# Altium schematic sheet NB992F_XL_N76E003_MAIN.SchDoc
size A4
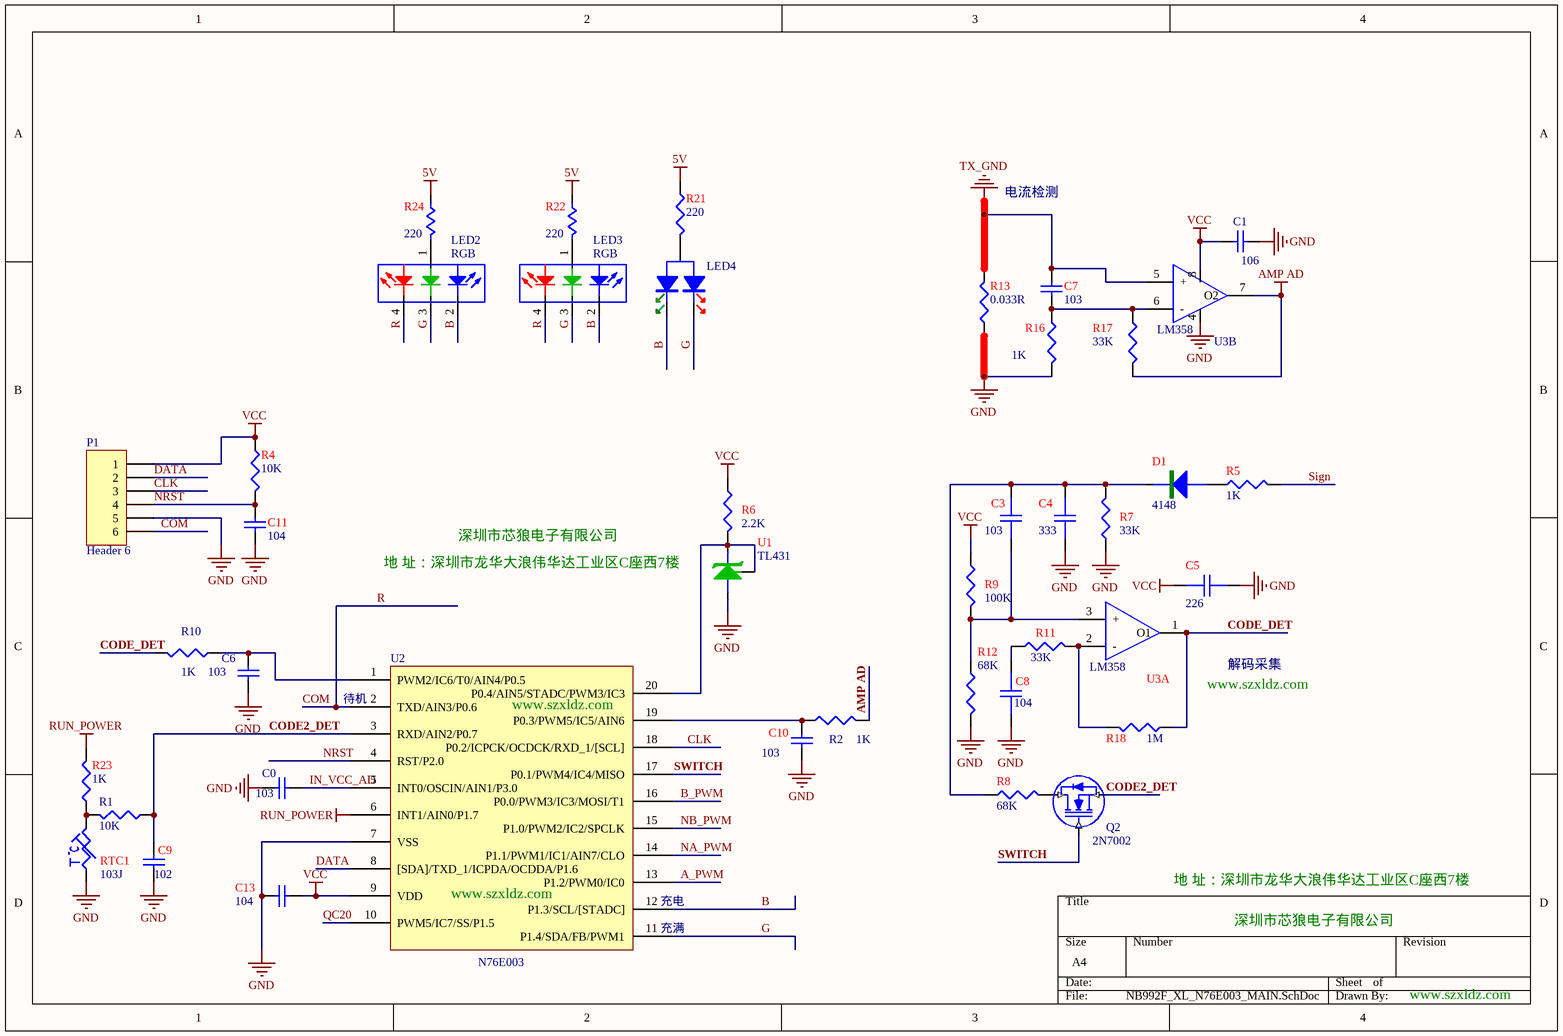
[diagram p0: NB992F_XL_N76E003_MAIN.SchDoc]

## Parts
C0  103  [C0402]
C1  106  [C0603]
C3  103  [C0402]
C4  333  [C0402]
C5  226  [C0805]
C6  103  [C0402]
C7  103  [C0402]
C8  104  [C0402]
C9  102  [C0402]
C10  103  [C0402]
C11  104  [C0402]
C13  104  [C0402]
D1  4148  [sod323]
LED2  RGB  [LED-RGB02]
LED3  RGB  [LED-RGB02]
LED4  (no value)  [LED2]
P1  Header 6  [SPIN6]
Q2  2N7002  [SOT-23B]
R1  10K  [R0402]
R2  1K  [R0402]
R4  10K  [R0402]
R5  1K  [R0402]
R6  2.2K  [R0402]
R7  33K  [R0402]
R8  68K  [R0402]
R9  100K  [R0402]
R10  1K  [R0402]
R11  33K  [R0402]
R12  68K  [R0402]
R13  0.033R  [R0805]
R16  1K  [R0402]
R17  33K  [R0402]
R18  1M  [R0402]
R21  220  [R0402]
R22  220  [R0402]
R23  1K  [R0402]
R24  220  [R0402]
RTC1  103J  [R0402]
U1  TL431  [SOT-23A]
U2  N76E003  [TSSOP20]
U3  LM358  [SOP8]  (parts A,B of 2)

## Nets
5V: R21.1 R22.1 R24.1
AMP AD: R2.2 R17.2 U3.7(O2)
GND: C0.1 C1.1 C4.1 C5.1 C6.1 C8.1 C9.1 C10.2 C11.2 C13.1 P1.5 R7.1 R12.2 R13.1 R16.2 RTC1.1 U1.1 U2.7(VSS) U3.4
RUN_POWER: R23.2 U2.6(INT1/AIN0/P1.7)
TX_GND: C7.1 R13.2 U3.5(+)
VCC: C1.2 C5.2 C13.2 P1.1 R4.1 R6.1 R9.1 U2.9(VDD) U3.8
A_PWM: U2.13(P1.2/PWM0/IC0)
B: LED2.2(A) LED3.2(A) LED4.3 U2.12(P1.3/SCL/[STADC])
B_PWM: U2.16(P0.0/PWM3/IC3/MOSI/T1)
CLK: P1.3 U2.18(P0.2/ICPCK/OCDCK/RXD_1/[SCL])
CODE2_DET: C9.2 Q2.E(S) R1.1 U2.3(RXD/AIN2/P0.7)
CODE_DET: R10.2 R18.1 U3.1(O1)
COM: LED2.4 LED3.4 P1.6 U2.2(TXD/AIN3/P0.6)  [also labelled R]
DATA: P1.2 U2.8([SDA]/TXD_1/ICPDA/OCDDA/P1.6)
G: LED2.3 LED3.3 LED4.1 U2.11(P1.4/SDA/FB/PWM1)
IN_VCC_AD: C0.2 U2.5(INT0/OSCIN/AIN1/P3.0)
NA_PWM: U2.14(P1.1/PWM1/IC1/AIN7/CLO)
NB_PWM: U2.15(P1.0/PWM2/IC2/SPCLK)
NRST: C11.1 P1.4 R4.2 U2.4(RST/P2.0)
QC20: U2.10(PWM5/IC7/SS/P1.5)
Sign: R5.2
SWITCH: Q2.B(G) U2.17(P0.1/PWM4/IC4/MISO)
NetC3_1: C3.1 C4.2 D1.2 R7.2 R8.1
NetC3_2: C3.2 R9.2 R12.1 U3.3(+)
NetC6_2: C6.2 R10.1 U2.1(PWM2/IC6/T0/AIN4/P0.5)
NetC7_2: C7.2 R16.1 R17.1 U3.6(-)
NetC8_2: C8.2 R11.1
NetC10_1: C10.1 R2.1 U2.19(P0.3/PWM5/IC5/AIN6)
NetD1_1: D1.1 R5.1
NetLED2_1: LED2.1(A) R24.2
NetLED3_1: LED3.1(A) R22.2
NetLED4_2: LED4.2 R21.2
NetQ2_C: Q2.C(D) R8.2
NetR1_2: R1.2 R23.1 RTC1.2
NetR6_2: R6.2 U1.2 U1.3 U2.20(P0.4/AIN5/STADC/PWM3/IC3)
NetR11_2: R11.2 R18.2 U3.2(-)

## Notes on the sheet
- 电流检测
- 地 址：深圳市龙华大浪伟华达工业区C座西7楼
- 深圳市芯狼电子有限公司
- (near U2) 待机
- (near U2) www.szxldz.com
- www.szxldz.com
- 解码采集
- (near U2) 充电
- (near U2) 充满

## Library data of the parts
C0 C6 C9-C11 C13 = Cap: Capacitor; Published: 8-Jun-2000; LatestRevisionDate: 17-Jul-2002; LatestRevisionNote: Re-released for DXP Platform.; Publisher: Altium Limited
  C6 C10: Value: 103
  C9: Value: 102
  C11: Value: 104
C1 C7 = Cap: Capacitor; Value: 104; Published: 8-Jun-2000; LatestRevisionDate: 17-Jul-2002; LatestRevisionNote: Re-released for DXP Platform.; Publisher: Altium Limited
C3-C5 C8 = CH
D1 = D0: 1N4001
LED2 LED3 = LED05
LED4 = LED2A
P1 = Header 6: Header, 6-Pin; LatestRevisionDate: 17-Jul-2002; LatestRevisionNote: Re-released for DXP Platform.; Publisher: Altium Limited
Q2 = MOSFETN
R1 R6-R9 R11-R13 R17 R18 R21 = R: 1K
R2 R4 R5 R10 R16 R23 = R
R22 R24 = Res01
RTC1 = RTC
U1 = IC TL431: IC
U2 = 103F
U3 = 4558